# Altium schematic sheet spine_1.SchDoc
size 120 x 114 mm; Origin: Eagle; OriginPath: C:\Users\jpvgo\OneDrive\Documents\Atombot Fase 2\Helium_Electronics\July31CommBrd\SPIne-master\SPIne_V2\SPIne\spine.sch; OriginSheet: 2; OriginDescription: Connectors
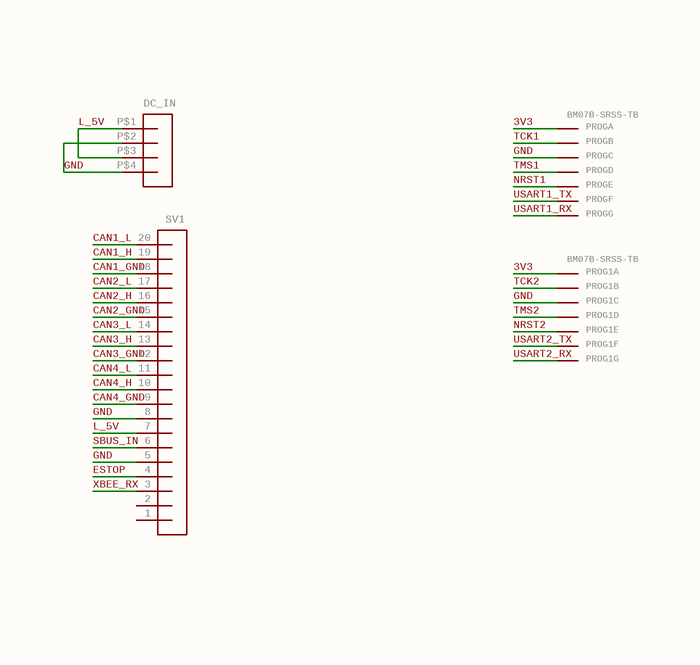
[diagram p0: spine_1.SchDoc]

## Parts
DC_IN  HEADER_POS4_?43045-0401  [43045-0400]  (value not drawn)
PROG  BM07B-SRSS-TB  [BM07B-SRSS-TB]  (parts A,B,C,D,E,F,G of 7)
PROG1  BM07B-SRSS-TB  [BM07B-SRSS-TB]  (parts A,B,C,D,E,F,G of 7)
SV1  MA20-1L  [MA20-1L]  (value not drawn)

## Nets
3V3: PROG.1(S) PROG1.1(S)
CAN1_GND: SV1.18
CAN1_H: SV1.19
CAN1_L: SV1.20
CAN2_GND: SV1.15
CAN2_H: SV1.16
CAN2_L: SV1.17
CAN3_GND: SV1.12
CAN3_H: SV1.13
CAN3_L: SV1.14
CAN4_GND: SV1.9
CAN4_H: SV1.10
CAN4_L: SV1.11
ESTOP: SV1.4
GND: DC_IN.P$1 DC_IN.P$2 DC_IN.P$3 DC_IN.P$4 PROG.3(S) PROG1.3(S) SV1.5 SV1.7 SV1.8  [also labelled L_5V]
NRST1: PROG.5(S)
NRST2: PROG1.5(S)
SBUS_IN: SV1.6
TCK1: PROG.2(S)
TCK2: PROG1.2(S)
TMS1: PROG.4(S)
TMS2: PROG1.4(S)
USART1_RX: PROG.7(S)
USART1_TX: PROG.6(S)
USART2_RX: PROG1.7(S)
USART2_TX: PROG1.6(S)
XBEE_RX: SV1.3

Not connected (* = marked no-connect by the designer): SV1 1 2

## Library data of the parts
DC_IN = HEADER_POS4_?43045-0401: Molex - Micro-Fit 3.0 Series connector,  3.00mm (0.118") pitch header, 4 positions.; GateName_1: G$1; SymbolName_1: HEADER_POS4; DeviceName: 43045-0401; LibraryName: con-molex-micro-fit-3_0; DeviceSetName: HEADER_POS4_?; MATERIAL: MATERIAL
PROG PROG1 = ?M07B-SRSS-TBB: Disconnectable Crimp style connector, 1.0mm pitch 7 contacts; GateName_1: -1; SymbolName_1: KV; GateName_2: -2; SymbolName_2: K; GateName_3: -3; GateName_4: -4; GateName_5: -5; GateName_6: -6; GateName_7: -7; DeviceName: B; SymbolName_3: K; SymbolName_4: K; SymbolName_5: K; SymbolName_6: K; SymbolName_7: K; LibraryName: con-jst2; DeviceSetName: ?M07B-SRSS-TB
SV1 = MA20-1L: PIN HEADER; GateName_1: 1; SymbolName_1: MA20-1; LibraryName: con-lstb; DeviceSetName: MA20-1L; MF: MF; MPN: MPN; OC_FARNELL: unknown; OC_NEWARK: unknown